# EAGLE schematic emonDCduo-ESP v1.0 (EAGLE 7.7.0)
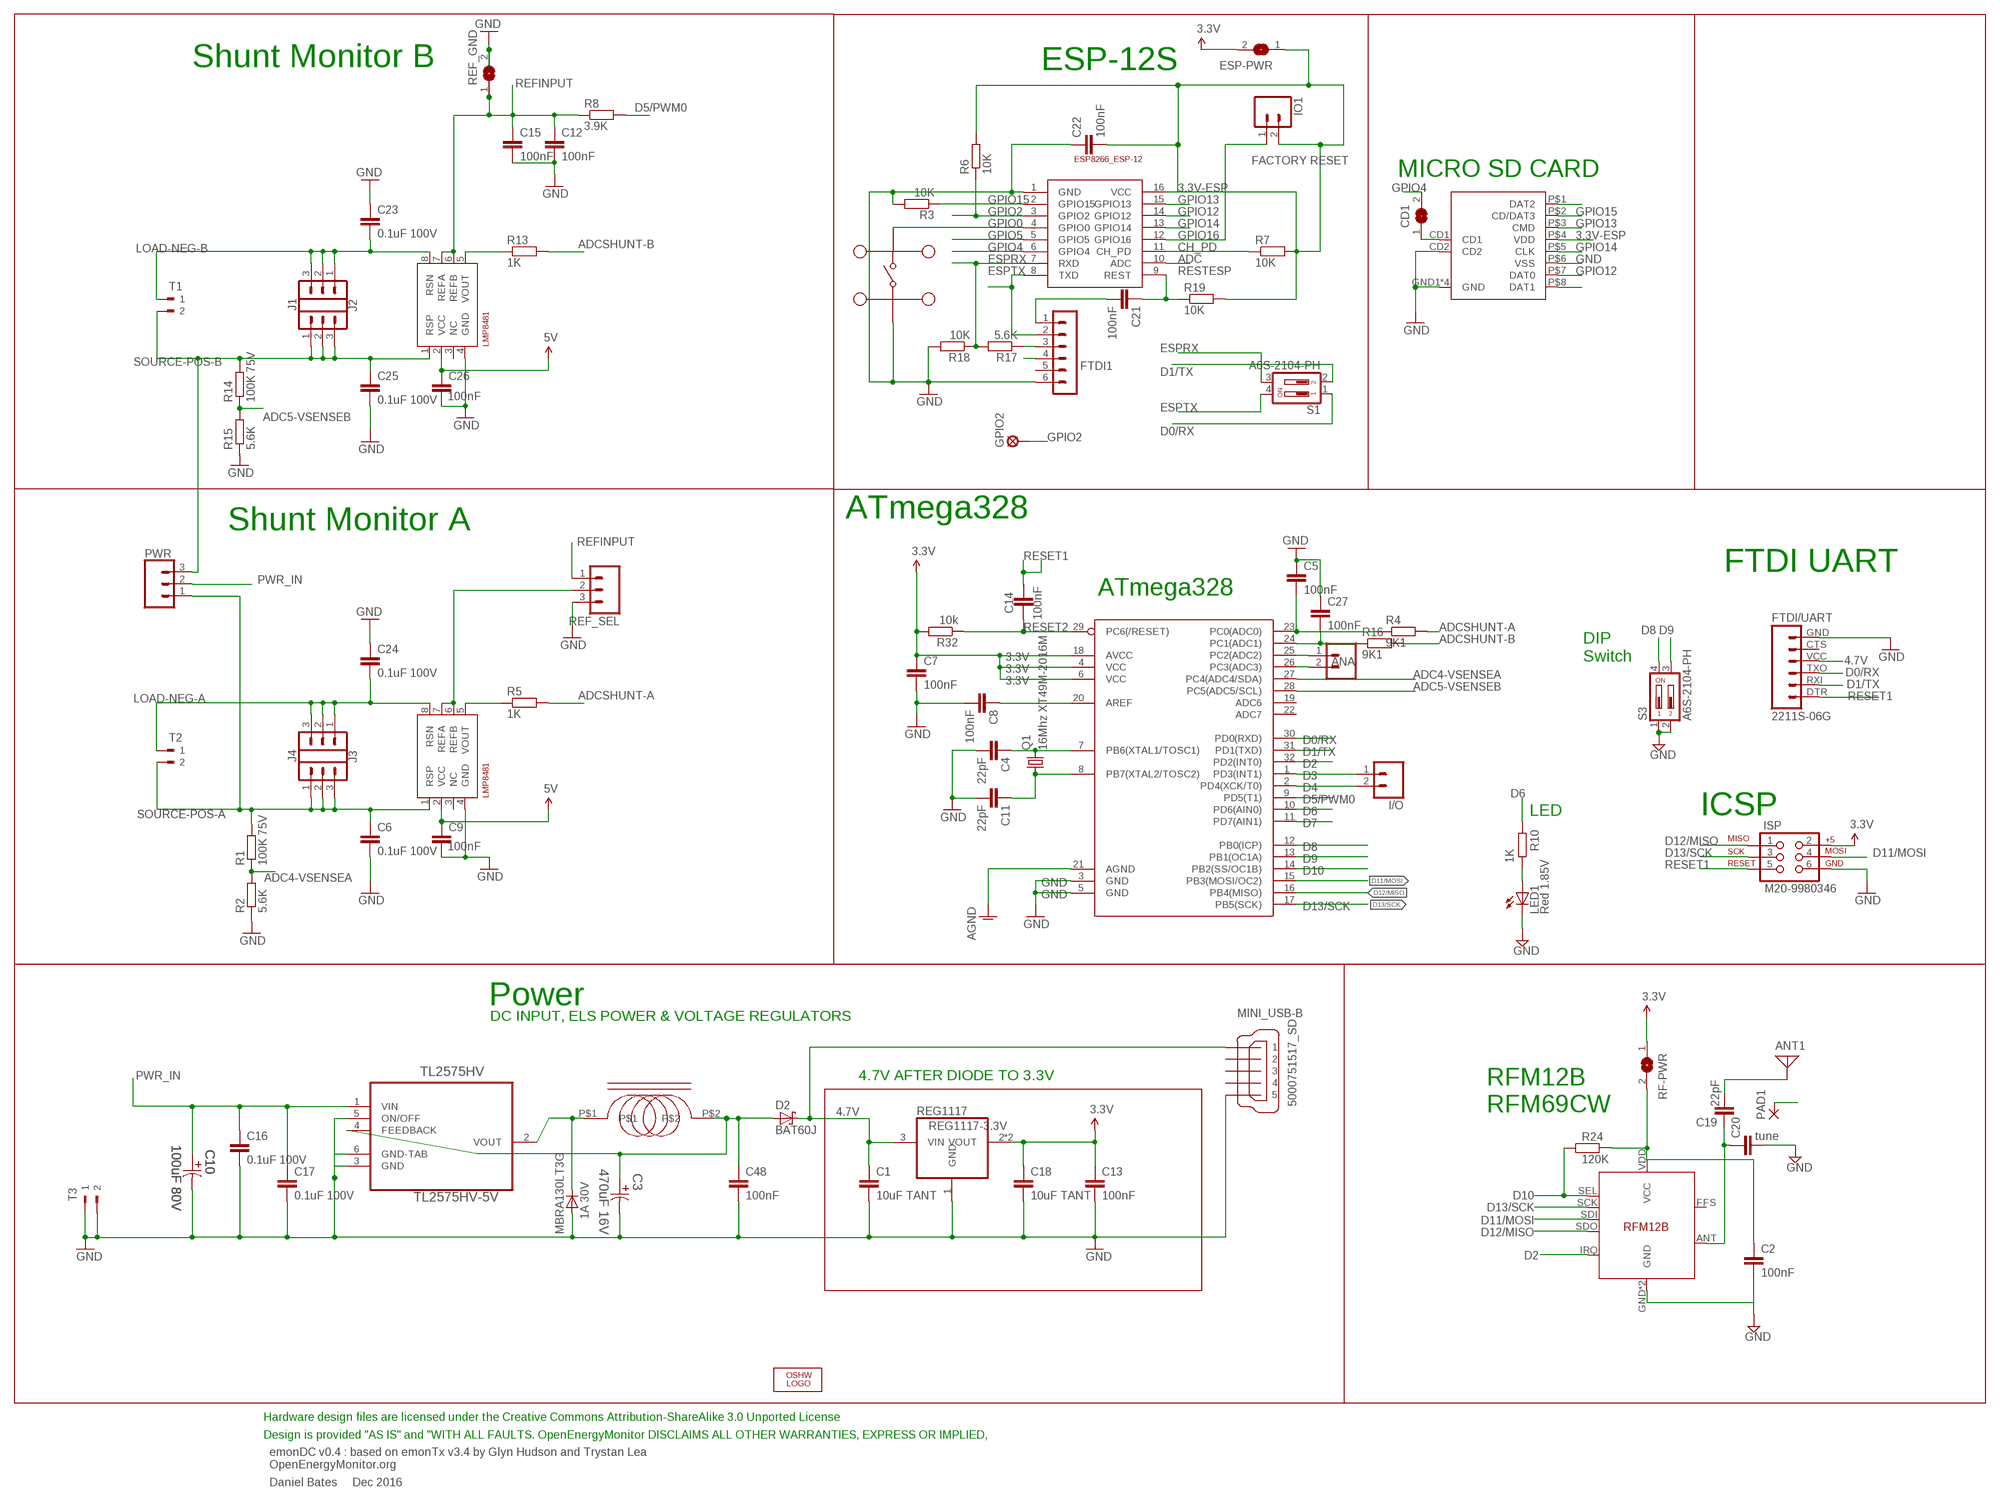
[diagram p0: schematic, sheet 1]

## Parts
ANA  2212S-02SG-85  M02LOCK  [1X02_LOCK]
ANT1  ANTENNA  [PAD-01]
C1  10uF TANT  C-EUC0603  [C0603]
C2  100nF  C-EUC0603  [C0603]
C3  470uF 16V  EEE-FK1C471P-CASE-F  [CAPAE830X1050N]
C4  22pF  C-EUC0603  [C0603]
C5  100nF  C-EUC0603  [C0603]
C6  0.1uF 100V  C-EUC0603  [C0603]
C7  100nF  C-EUC0603  [C0603]
C8  100nF  C-EUC0603  [C0603]
C9  100nF  C-EUC0603  [C0603]
C10  100uF 80V  EEV-FK1K101Q-CASE-H13  [CAPAE1350X1400N]
C11  22pF  C-EUC0603  [C0603]
C12  100nF  C-EUC0603  [C0603]
C13  100nF  C-EUC0603  [C0603]
C14  100nF  C-EUC0603  [C0603]
C15  100nF  C-EUC0603  [C0603]
C16  0.1uF 100V  C-EUC0603  [C0603]
C17  0.1uF 100V  C-EUC0603  [C0603]
C18  10uF TANT  C-EUC0603  [C0603]
C19  22pF  C-EUC0603  [C0603]
C20  tune  C-EUC0603  [C0603]
C21  100nF  C-EUC0603  [C0603]
C22  100nF  C-EUC0603  [C0603]
C23  0.1uF 100V  C-EUC0603  [C0603]
C24  0.1uF 100V  C-EUC0603  [C0603]
C25  0.1uF 100V  C-EUC0603  [C0603]
C26  100nF  C-EUC0603  [C0603]
C27  100nF  C-EUC0603  [C0603]
C48  100nF  C-EUC0603  [C0603]
CD1  SJ  [SJ]
D1  MBRA130LT3G  [DO-214]
D2  BAT60J  [SOD323_ST]
ESP-12  ESP8266_ESP-12  [ESP8266-ESP12]
ESP-PWR  SJ  [SJ]
FTDI1  FTDI-ESP  MA06-1  [MA06-1]
FTDI/UART  2211S-06G  FTDI_BASICPTH  [FTDI_BASIC]
GPIO2  LSP11  [LSP11]
I1  330uH  SRR0603-331KL  [SRR0603-331KL]
I/O  2212S-02SG-85  M02LOCK  [1X02_LOCK]
IO1  M02PTH  [1X02]
ISP  M20-9980346  AVR_SPI_PRG_6PTH  [2X3]
J1  CONN_03  [1X03]
J2  CONN_03  [1X03]
J3  CONN_03  [1X03]
J4  CONN_03  [1X03]
LED1  Red 1.85V  LEDCHIP-LED0805  [CHIP-LED0805]
LOGO1  OSHW_LOGO_6MILX0200-NT  [OSHW_6X200_NOTEXT]
MC2  MC32882  [SWITCH_TACT_MULTICOMP]
MINI_USB-B  5000751517_SD  [5000751517_SD]
PAD1  SMD2  [SMD1,27-2,54]
PWR  CONN_03  [1X03]
Q1  16Mhz XT49M-2016M  CRYSTALHC49UP  [HC49UP]
R1  100K 75V  R-EU_R0603  [R0603]
R2  5.6K  R-EU_R0603  [R0603]
R3  10K  R-EU_R0603  [R0603]
R4  9K1  R-EU_R0603  [R0603]
R5  1K  R-EU_R0603  [R0603]
R6  10K  R-EU_R0603  [R0603]
R7  10K  R-EU_R0603  [R0603]
R8  3.9K  R-EU_R0603  [R0603]
R10  1K  R-EU_R0603  [R0603]
R13  1K  R-EU_R0603  [R0603]
R14  100K 75V  R-EU_R0603  [R0603]
R15  5.6K  R-EU_R0603  [R0603]
R16  9K1  R-EU_R0603  [R0603]
R17  5.6K  R-EU_R0603  [R0603]
R18  10K  R-EU_R0603  [R0603]
R19  10K  R-EU_R0603  [R0603]
R24  120K  R-EU_R0603  [R0603]
R32  10k  R-EU_R0603  [R0603]
REF_GND  SJ  [SJ]
REF_SEL  2212S-02SG-85  CONN_03  [1X03]
REG1117  REG1117-3.3V  REG1117-VOUT4  [SOT223]
RF  RFM12B  [RFM12B]
RF-PWR  SJ  [SJ]
S1  A6S-2104-PH  2_SMT_DIP_SWITCH  [DIP_SWITCH_SMT]
S3  A6S-2104-PH  2_SMT_DIP_SWITCH  [DIP_SWITCH_SMT]
SHUNTMON-A  LMP8481  LMP8481-H  [S-PDSO-G08]
SHUNTMON-B  LMP8481  LMP8481-H  [S-PDSO-G08]
T1  180-2  [180-2]
T2  180-2  [180-2]
T3  180-2  [180-2]
TL2575HV  TL2575HV-5V  TL2575HV-05IKTTR  [TO-263]
U1_TQFP  ATMEGA328P  ATMEGA328_SMT  [TQFP32-08]
U$2  MOLEX_MICRO_SD_1040310811  [MOLEX_MICROSD_EXPOSED]

## Nets
3.3V: C7.1 C13.1 C18.1 ESP-PWR.2 ISP.2 R32.2 REG1117.2(VOUT) REG1117.4(VOUT) RF-PWR.1 U1_TQFP.4(VCC) U1_TQFP.6(VCC) U1_TQFP.18(AVCC)
3.3V-ESP: C22.2 ESP-12.16(VCC) ESP-PWR.1 IO1.2 R6.2 R7.2 R19.2 U$2.P$4(VDD)
3.3V-RF: C2.1 R24.2 RF-PWR.2 RF.VDD(VCC)
4.7V [power]: C1.1 C9.1 C26.1 D2.C FTDI1.4 FTDI/UART.VCC MINI_USB-B.VBUS REG1117.3(VIN) SHUNTMON-A.2(VCC) SHUNTMON-B.2(VCC) ; supply symbol labelled 5V
5.0V [power]: C3.1 C48.1 D2.A I1.P$2 TL2575HV.4(FEEDBACK)
ADC: ESP-12.10(ADC)
ADC0: C5.2 R4.1 U1_TQFP.23(PC0(ADC0))
ADC1: C27.2 R16.1 U1_TQFP.24(PC1(ADC1))
ADC2: ANA.1 U1_TQFP.25(PC2(ADC2))
ADC3: ANA.2 U1_TQFP.26(PC3(ADC3))
ADC4-VSENSEA: R1.1 R2.2 U1_TQFP.27(PC4(ADC4/SDA))
ADC5-VSENSEB: R14.1 R15.2 U1_TQFP.28(PC5(ADC5/SCL))
ADCSHUNT-A: R4.2 R5.2
ADCSHUNT-B: R13.2 R16.2
AGND [thin_power]: U1_TQFP.21(AGND)
CH_PD: ESP-12.11(CH_PD) R7.1
D0/RX: FTDI/UART.TXO S1.1 U1_TQFP.30(PD0(RXD))
D1/TX: FTDI/UART.RXI S1.2 U1_TQFP.31(PD1(TXD))
D2: RF.IRQ U1_TQFP.32(PD2(INT0))
D3: I/O.1 U1_TQFP.1(PD3(INT1))
D4: I/O.2 U1_TQFP.2(PD4(XCK/T0))
D5/PWM0: R8.2 U1_TQFP.9(PD5(T1))
D6: R10.2 U1_TQFP.10(PD6(AIN0))
D7: U1_TQFP.11(PD7(AIN1))
D8: S3.4 U1_TQFP.12(PB0(ICP))
D9: S3.3 U1_TQFP.13(PB1(OC1A))
D10: R24.1 RF.SEL U1_TQFP.14(PB2(SS/OC1B))
D11/MOSI: ISP.4 RF.SDI U1_TQFP.15(PB3(MOSI/OC2))
D12/MISO: ISP.1 RF.SDO U1_TQFP.16(PB4(MISO))
D13/SCK: ISP.3 RF.SCK U1_TQFP.17(PB5(SCK))
DIG1: C19.1 C20.1 RF.ANT
ESPRX: ESP-12.7(RXD) R17.2 R18.1 S1.3
ESPTX: ESP-12.8(TXD) FTDI1.2 S1.4
GND [thin_power]: C1.2 C2.2 C3.2 C4.2 C5.1 C6.2 C7.2 C8.2 C9.2 C10.2 C11.2 C12.2 C13.2 C15.2 C16.2 C17.2 C18.2 C20.2 C22.1 C23.1 C24.1 C25.2 C26.2 C27.1 C48.2 D1.P$2(A) ESP-12.1(GND) FTDI1.6 FTDI/UART.GND ISP.6 LED1.C MC2.P$1 MC2.P$2 MINI_USB-B.GND1 MINI_USB-B.GND2 MINI_USB-B.GND3 R2.1 R3.2 R15.1 R18.2 REF_GND.2 REF_SEL.3 REG1117.1(GND) RF.GND RF.P$12(GND) S3.1 S3.2 SHUNTMON-A.4(GND) SHUNTMON-B.4(GND) T3.1 T3.2 TL2575HV.3(GND) TL2575HV.5(ON/OFF) TL2575HV.6(GND-TAB) U1_TQFP.3(GND) U1_TQFP.5(GND) U$2.CD2 U$2.GND1(GND) U$2.GND2(GND) U$2.GND3(GND) U$2.GND4(GND) U$2.P$6(VSS)
GPIO0: ESP-12.4(GPIO0) MC2.P$3 MC2.P$4
GPIO2: ESP-12.3(GPIO2) GPIO2.MP R6.1
GPIO4: CD1.2 ESP-12.6(GPIO4)
GPIO5: ESP-12.5(GPIO5)
GPIO12: ESP-12.14(GPIO12) U$2.P$7(DAT0)
GPIO13: ESP-12.15(GPIO13) U$2.P$3(CMD)
GPIO14: ESP-12.13(GPIO14) U$2.P$5(CLK)
GPIO15 [thin_power]: ESP-12.2(GPIO15) R3.1 U$2.P$2(CD/DAT3)
GPIO16: ESP-12.12(GPIO16) IO1.1
IND: D1.P$1(C) I1.P$1 TL2575HV.2(VOUT)
LOAD-NEG-A: C24.2 J4.1 J4.2 J4.3 SHUNTMON-B.8(RSN) T2.1
LOAD-NEG-B: C23.2 J1.1 J1.2 J1.3 SHUNTMON-A.8(RSN) T1.1
N$1: C4.1 Q1.2 U1_TQFP.7(PB6(XTAL1/TOSC1))
N$3: ANT1.1 C19.2
N$4: R13.1 SHUNTMON-A.5(VOUT)
N$5: PAD1.1(P)
N$6: R5.1 SHUNTMON-B.5(VOUT)
N$7: U$2.P$1(DAT2)
N$9: C11.1 Q1.1 U1_TQFP.8(PB7(XTAL2/TOSC2))
N$10: CD1.1 U$2.CD1
N$11 [thin_power]: REF_SEL.2 SHUNTMON-B.6(REFB) SHUNTMON-B.7(REFA)
N$20: C8.1 U1_TQFP.20(AREF)
N$30: C21.2 FTDI1.1
N$32: U$2.P$8(DAT1)
N$36: FTDI1.3 R17.1
N$41: LED1.A R10.1
PWR_IN: C10.1 C16.1 C17.1 PWR.2 TL2575HV.1(VIN)
REFINPUT: C12.1 C15.1 R8.1 REF_GND.1 REF_SEL.1 SHUNTMON-A.6(REFB) SHUNTMON-A.7(REFA)
RESET1: C14.2 FTDI/UART.DTR ISP.5
RESET2: C14.1 R32.1 U1_TQFP.29(PC6(/RESET))
RESTESP: C21.1 ESP-12.9(REST) R19.1
SOURCE-POS-A: C6.1 J3.1 J3.2 J3.3 PWR.1 R1.2 SHUNTMON-B.1(RSP) T2.2
SOURCE-POS-B: C25.1 J2.1 J2.2 J2.3 PWR.3 R14.2 SHUNTMON-A.1(RSP) T1.2
Unconnected: FTDI1.5 FTDI/UART.CTS MINI_USB-B.D+ MINI_USB-B.D- MINI_USB-B.ID RF.FFS SHUNTMON-A.3(NC) SHUNTMON-B.3(NC) U1_TQFP.19(ADC6) U1_TQFP.22(ADC7)

## Notes on the sheet
- Shunt Monitor B | ESP-12S
- FACTORY RESET
- MICRO SD CARD
- ATmega328
- Shunt Monitor A
- FTDI UART
- ATmega328
- DIP
  Switch
- LED | ICSP
- Power
- DC INPUT, ELS POWER & VOLTAGE REGULATORS
- 4.7V AFTER DIODE TO 3.3V
- RFM12B
  RFM69CW
- Hardware design files are licensed under the Creative Commons Attribution-ShareAlike 3.0 Unported License
- Design is provided "AS IS" and "WITH ALL FAULTS. OpenEnergyMonitor DISCLAIMS ALL OTHER WARRANTIES, EXPRESS OR IMPLIED,
- emonDC v0.4 : based on emonTx v3.4 by Glyn Hudson and Trystan Lea
  OpenEnergyMonitor.org
- Daniel Bates     Dec 2016

## Library data of the parts
ANA I/O = SparkFun-Connectors:M02: Standard 2-pin 0.1" header. Use with - straight break away headers ( PRT-00116) - right angle break away headers (PRT-00553) - swiss pins (PRT-00743) - machine pins (PRT-00117) - female headers (PRT-00115) Molex polarized connector foot print use with: PRT-08233 with associated crimp pins and housings. 2.54_SCREWTERM for use with PRT-10571. 3.5mm Screw Terminal footprints for PRT-08084 5mm Screw Terminal footprints for use with PRT-08432; MF: MULTICOMP; MPN: 2212S-02SG-85; OC_FARNELL: 1593458
ANT1 = discrete:ANTENNA: Antenna; OC_FARNELL: unknown
C1 C2 C4 C5 C7 C8 C11-C14 C16-C22 C27 C48 = rcl:C-EU: CAPACITOR, European symbol
C3 = Panasonic-EEEFK_EEEFP:EEE-: Aluminum Electrolytic Capacitors,Surface Mount Type; MPN: EEE-FK1C471P; OC_FARNELL: 9695710; OC_NEWARK: 96K9385; PACKAGE: CASE-F; SUPPLIER: PANASONIC; TOLERANCE: ±20 %; VALUE: 470UF; VOLTAGERATING: 16V
C6 C9 C15 C23-C26 = rcl:C-EU: CAPACITOR, European symbol; MPN: C1608X7S2A104K080AB
C10 = Panasonic-EEE-EEV-EEF-ECQ:EEV-: Aluminum Electrolytic Capacitors,Surface Mount Type; MPN: EEVFK1K101Q; OC_FARNELL: 9696113; OC_NEWARK: 96K9484; SUPPLIER: PANASONIC; TOLERANCE: ±20 %; VALUE: 100UF; VOLTAGERATING: 80V
CD1 ESP-PWR REF_GND RF-PWR = jumper:SJ: SMD solder JUMPER
D1 = CASE 403D Diode:MBRA130LT3G: Fast switching diode; MF: ON SEMICONDUCTOR; MPN: MBRA130LT3G; OC_FARNELL: 9555978
D2 = diode:BAT60J: Schottky barrier diode Source: www.st.com, BAT60J.pdf
ESP-12 = ESP8266-ESP12:ESP8266_ESP-12
FTDI1 = JeeLabs:MA06-1: PIN HEADER
FTDI/UART = SparkFun:FTDI_BASIC: FTDI Basic: 3.3V and 5V; MF: MULTICOMP; MPN: 2211S-06G; OC_FARNELL: 1593415
GPIO2 = solpad:LSP11: SOLDER PAD drill 1.1 mm
I1 = SRR0603-331KL:SRR0603-331KL: SRR0603-331KL; INDUCTANCE: 330uH; MF: BOURNS; MPN: SRR0603-331KL; OC_FARNELL: 2333890
IO1 = SparkFun:M02: Header 2 Standard 2-pin 0.1" header. Use with straight break away headers (SKU : PRT-00116), right angle break away headers (PRT-00553), swiss pins (PRT-00743), machine pins (PRT-00117), and female headers (PRT-00115). Molex polarized connector foot print use with SKU : PRT-08233 with associated crimp pins and housings.
ISP = SparkFun:AVR_SPI_PRG_6: AVR ISP 6 Pin This is the reduced ISP connector for AVR programming. Common on Arduino. This footprint will take up less PCB space and can be used with a 10-pin to 6-pin adapter such as SKU: BOB-08508; MF: HARWIN; MPN: M20-9980346; OC_FARNELL: 1022231
J1-J4 PWR = SparkFun-Connectors:CONN_03: Multi connection point. Often used as Generic Header-pin footprint for 0.1 inch spaced/style header connections On any of the 0.1 inch spaced packages, you can populate with these: Break Away Headers - Straight <https://www.sparkfun.com/products/116> (PRT-00116) Break Away Male Headers - Right Angle <https://www.sparkfun.com/products/553> (PRT-00553) Female Headers <https://www.sparkfun.com/products/115> (PRT-00115) Break Away Headers - Machine Pin <https://www.sparkfun.com/products/117> (PRT-00117) Break Away Female Headers - Swiss Machine Pin <https://www.sparkfun.com/products/743> (PRT-00743) Stackable Header - 3 Pin (Female, 0.1") <https://www.sparkfun.com/products/13875> (PRT-13875) For SCREWTERMINALS and SPRING TERMINALS visit here: Screw Terimnals on SparkFun.com <https://www.sparkfun.com/search/results?term=Screw+Terminals> (5mm/3.5mm/2.54mm spacing) This device is also useful as a general connection point to wire up your design to another part of your project. Our various solder wires solder well into these plated through hole pads. Hook-Up Wire - Assortment (Stranded, 22 AWG) <https://www.sparkfun.com/products/11375> (PRT-11375) Hook-Up Wire - Assortment (Solid Core, 22 AWG) <https://www.sparkfun.com/products/11367> (PRT-11367) View the entire wire category on our website here <https://www.sparkfun.com/categories/141> Special notes: Molex polarized connector foot print use with SKU : PRT-08232 with associated crimp pins and housings.
LED1 = adafruit:LED: LED OSRAM: - CHIPLED LG R971, LG N971, LY N971, LG Q971, LY Q971, LO R971, LY R971 LH N974, LH R974 LS Q976, LO Q976, LY Q976 LO Q996 - Hyper CHIPLED LW Q18S LB Q993, LB Q99A, LB R99A - SideLED LS A670, LO A670, LY A670, LG A670, LP A670 LB A673, LV A673, LT A673, LW A673 LH A674 LY A675 LS A676, LA A676, LO A676, LY A676, LW A676 LS A679, LY A679, LG A679 - Hyper Micro SIDELED® LS Y876, LA Y876, LO Y876, LY Y876 LT Y87S - SmartLED LW L88C, LW L88S LB L89C, LB L89S, LG L890 LS L89K, LO L89K, LY L89K LS L896, LA L896, LO L896, LY L896 - TOPLED LS T670, LO T670, LY T670, LG T670, LP T670 LSG T670, LSP T670, LSY T670, LOP T670, LYG T670 LG T671, LOG T671, LSG T671 LB T673, LV T673, LT T673, LW T673 LH T674 LS T676, LA T676, LO T676, LY T676, LB T676, LH T676, LSB T676, LW T676 LB T67C, LV T67C, LT T67C, LS T67K, LO T67K, LY T67K, LW E67C LS E67B, LA E67B, LO E67B, LY E67B, LB E67C, LV E67C, LT E67C LW T67C LS T679, LY T679, LG T679 LS T770, LO T770, LY T770, LG T770, LP T770 LB T773, LV T773, LT T773, LW T773 LH T774 LS E675, LA E675, LY E675, LS T675 LS T776, LA T776, LO T776, LY T776, LB T776 LHGB T686 LT T68C, LB T68C - Hyper Mini TOPLED® LB M676 - Mini TOPLED Santana® LG M470 LS M47K, LO M47K, LY M47K Source: http://www.osram.convergy.de/; MF: ROHM; MPN: SML-211UTT86K; OC_FARNELL: 1685056
LOGO1 = ohw-logo:OSHW_LOGO_6MIL; OC_FARNELL: unknown
MC2 = multicomp tact switch:MC32882
MINI_USB-B = 5000751517_sd:5000751517_SD
PAD1 = wirepad:SMD2: SMD PAD
Q1 = adafruit:CRYSTAL: CRYSTAL; MF: VISHAY; MPN: XT49M-2016M; OC_FARNELL: 1469641; OC_NEWARK: unknown
R1 R14 = rcl:R-EU_: RESISTOR, European symbol; MPN: MCWR06X1003FTL
R2 R15 = rcl:R-EU_: RESISTOR, European symbol; MPN: MCWR06X5901FTL
R3-R8 R10 R13 R16-R19 R24 R32 = rcl:R-EU_: RESISTOR, European symbol
REF_SEL = SparkFun-Connectors:CONN_03: Multi connection point. Often used as Generic Header-pin footprint for 0.1 inch spaced/style header connections On any of the 0.1 inch spaced packages, you can populate with these: Break Away Headers - Straight <https://www.sparkfun.com/products/116> (PRT-00116) Break Away Male Headers - Right Angle <https://www.sparkfun.com/products/553> (PRT-00553) Female Headers <https://www.sparkfun.com/products/115> (PRT-00115) Break Away Headers - Machine Pin <https://www.sparkfun.com/products/117> (PRT-00117) Break Away Female Headers - Swiss Machine Pin <https://www.sparkfun.com/products/743> (PRT-00743) Stackable Header - 3 Pin (Female, 0.1") <https://www.sparkfun.com/products/13875> (PRT-13875) For SCREWTERMINALS and SPRING TERMINALS visit here: Screw Terimnals on SparkFun.com <https://www.sparkfun.com/search/results?term=Screw+Terminals> (5mm/3.5mm/2.54mm spacing) This device is also useful as a general connection point to wire up your design to another part of your project. Our various solder wires solder well into these plated through hole pads. Hook-Up Wire - Assortment (Stranded, 22 AWG) <https://www.sparkfun.com/products/11375> (PRT-11375) Hook-Up Wire - Assortment (Solid Core, 22 AWG) <https://www.sparkfun.com/products/11367> (PRT-11367) View the entire wire category on our website here <https://www.sparkfun.com/categories/141> Special notes: Molex polarized connector foot print use with SKU : PRT-08232 with associated crimp pins and housings.; MF: MULTICOMP; MPN: 2212S-02SG-85; OC_FARNELL: 1593458
REG1117 = burr-brown:REG1117-VOUT4: 800mA and 1A Low Dropout (LDO) Positive Regulator 1.8V, 2.5V, 2.85V, 3.3V, 5V, and Adj; MF: TEXAS INSTRUMENTS; MPN: REG1117; OC_FARNELL: 1097566; OC_NEWARK: 14P6981
RF = JeeParts:RFM12B; OC_FARNELL: unknown
S1 S3 = OpenEnergyMonitor:2_SMT_DIP_SWITCH: Multicomp MCEMR-02-T 2 throw SMT DIP switch, Farnell 1524005; MF: OMRON ELECTRONIC COMPONENTS; MPN: A6S2104H; OC_FARNELL: 1960894
SHUNTMON-A = lmp8481b:LMP8481: LMP8481MM-H/NOPB 100V/V; MF: TEXAS INSTRUMENTS; MPN: LMP8481MME-S/NOPB; OC_FARNELL: 2322044
SHUNTMON-B = lmp8481b:LMP8481: LMP8481MM-H/NOPB 100V/V; MF: TEXAS INSTRUMENTS; MPN: LMP8481MME-H/NOPB; OC_FARNELL: 2322044
T1-T3 = con-weidmueller-sl35:180-2: WEIDMUELLER CLAMP CONNECTOR; OC_FARNELL: unknown; OC_NEWARK: unknown
TL2575HV = TL2575HV:TL2575HV; MF: TEXAS INSTRUMENTS; MPN: LM2575HVS-15/NOPB; OC_FARNELL: 2492609
U1_TQFP = SparkFun-DigitalIC:ATMEGA328_SMT: 32-Pin Atmega328 part Commonly used on Arduino compatible boards Available in QFP and QFN packages TQFP is IC-09069 QFN is non-stock; MF: ATMEL; MPN: ATMEGA328P-AU; OC_FARNELL: 1972086; PROD_ID: IC-09069
U$2 = MOLEX MICRO SD [exposed pins]:MOLEX_MICRO_SD_1040310811

## Net classes
2 thin_power: width 0.254 mm